# Altium schematic sheet ESP8266_PWR_CTRL.SchDoc
size A; SheetNumber: 22; SheetTotal: 30
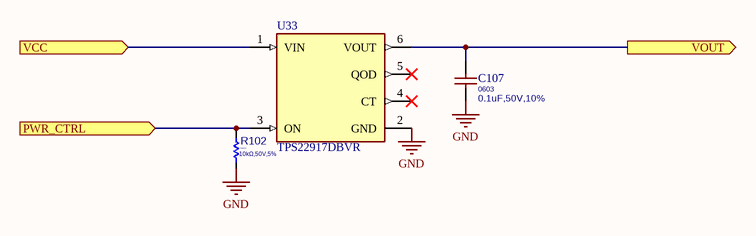
[diagram p0: ESP8266_PWR_CTRL.SchDoc]

## Parts
C107  Package: 0603  [C0603]  (hidden comment: 0.1uF,50V,10%)
R102  value 10kΩ,50V,5%  Package: 0402  [R0402]  (hidden comment: 10kΩ)
U33  TPS22917DBVR  [SOT95P280X145-6N]

## Ports
PWR_CTRL (in), VCC (in), VOUT (out)

## Nets
GND: C107.1 R102.1 U33.2(GND)
PWR_CTRL: R102.2 U33.3(ON) ; port PWR_CTRL
VCC: U33.1(VIN) ; port VCC
VOUT: C107.2 U33.6(VOUT) ; port VOUT

Not connected (* = marked no-connect by the designer): U33 4(CT)* 5(QOD)*

## Library data of the parts
C107 = GCM188R71H104KA57J: CAP CER 0.1UF 50V X7R 0603; Manufacturer: Murata Electronics; Type: SM; Min Operating Temp: -55°C; Max Operating Temp: 125°C; MPN: GCM188R71H104KA57J; Datasheet: https://datasheet.lcsc.com/lcsc/2404081050_Murata-Electronics-GCM188R71H104KA57J_C3011652.pdf; LCSC: C3011652; Value: 0.1uF,50V,10%
R102 = RC0402JR-0710KL: 62.5mW Thick Film Resistors 50V ±100ppm/℃ ±5% 10kΩ 0402 Chip Resistor - Surface Mount ROHS; Manufacturer: YAGEO; MPN: RC0402JR-0710KL; Max Operating Temp: +155; Min Operating Temp: -55; Datasheet: https://datasheet.lcsc.com/lcsc/1810241334_YAGEO-RC0402JR-0710KL_C60489.pdf; LCSC: C60489
U33 = TPS22917DBVR: 5.5-V, 2-A, 80-mÎ© , 10-nA leakage load switch adj. rise time and adj output discharge; MF: Texas Instruments; SnapEDA_Link: https://www.snapeda.com/parts/TPS22917DBVR/Texas+Instruments/view-part/?ref=snap; Package: SOT-23-6 Texas Instruments; Value: *; MP: TPS22917DBVR; Check_prices: https://www.snapeda.com/parts/TPS22917DBVR/Texas+Instruments/view-part/?ref=eda